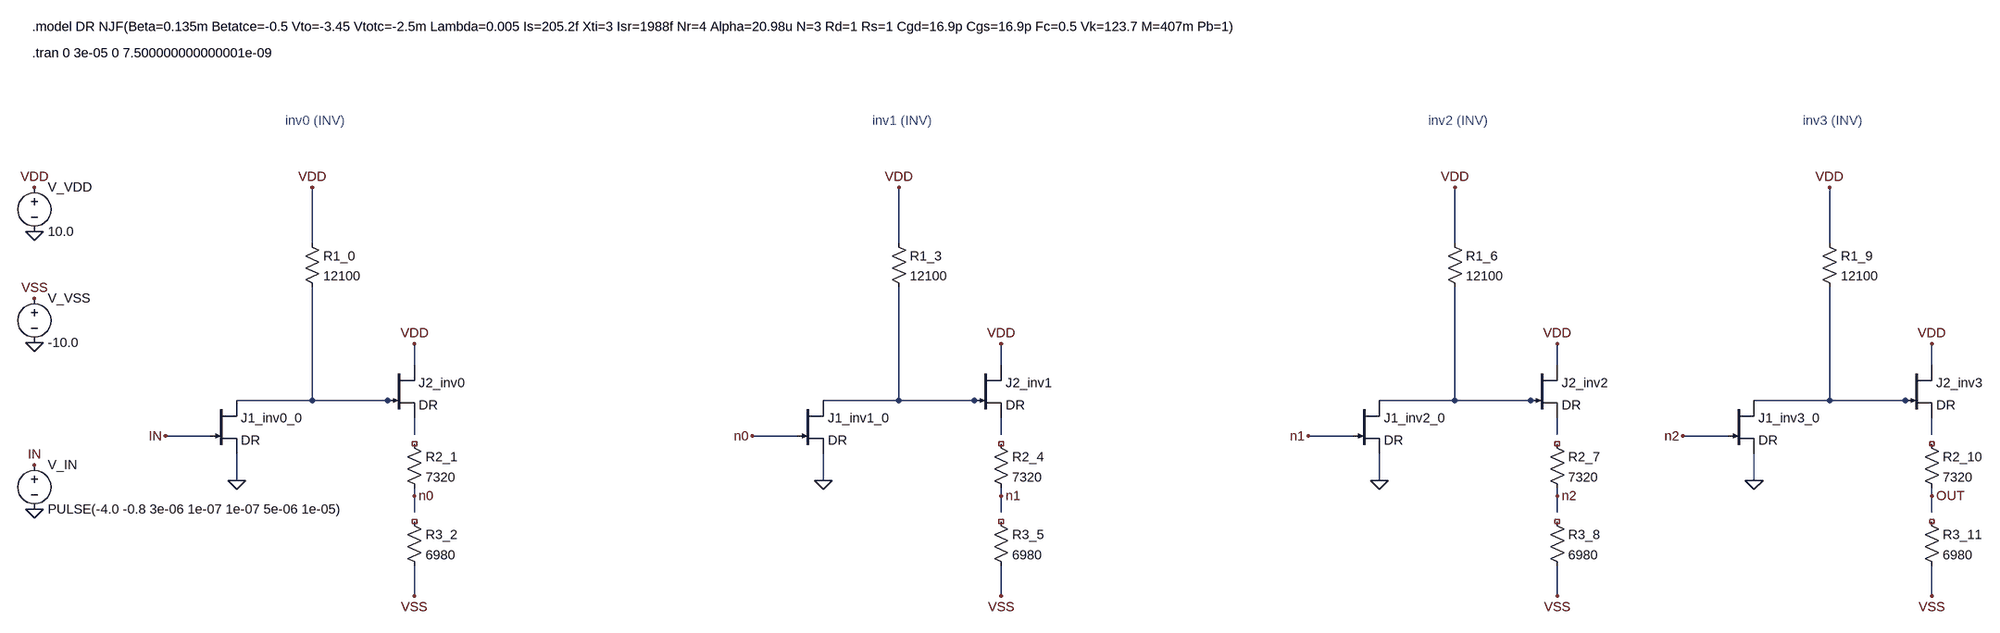
[diagram p0: schematic inv_chain_4_v2.asc]
inv_chain_4_v2.asc, the LTspice schematic file:
Version 4
SHEET 1 10000 10000
WIRE 0 116 0 16
FLAG 0 16 VDD
SYMBOL res -16 100 R0
SYMATTR InstName R1_0
SYMATTR Value 12100
WIRE 0 400 0 196
WIRE 0 400 -136 400
SYMBOL njf -184 400 R0
SYMATTR InstName J1_inv0_0
SYMATTR Value DR
WIRE -136 496 -136 544
FLAG -136 544 0
WIRE -184 464 -264 464
FLAG -264 464 IN
WIRE 0 400 136 400
SYMBOL njf 136 336 R0
SYMATTR InstName J2_inv0
SYMATTR Value DR
WIRE 184 336 184 298
FLAG 184 298 VDD
WIRE 136 400 136 400
WIRE 184 432 184 462
SYMBOL res 168 462 R0
SYMATTR InstName R2_1
SYMATTR Value 7320
WIRE 184 558 184 572
FLAG 184 572 n0
WIRE 184 572 184 602
SYMBOL res 168 602 R0
SYMATTR InstName R3_2
SYMATTR Value 6980
WIRE 184 698 184 752
FLAG 184 752 VSS
TEXT -48 -104 Left 2 ;inv0 (INV)
WIRE 1056 116 1056 16
FLAG 1056 16 VDD
SYMBOL res 1040 100 R0
SYMATTR InstName R1_3
SYMATTR Value 12100
WIRE 1056 400 1056 196
WIRE 1056 400 920 400
SYMBOL njf 872 400 R0
SYMATTR InstName J1_inv1_0
SYMATTR Value DR
WIRE 920 496 920 544
FLAG 920 544 0
WIRE 872 464 792 464
FLAG 792 464 n0
WIRE 1056 400 1192 400
SYMBOL njf 1192 336 R0
SYMATTR InstName J2_inv1
SYMATTR Value DR
WIRE 1240 336 1240 298
FLAG 1240 298 VDD
WIRE 1192 400 1192 400
WIRE 1240 432 1240 462
SYMBOL res 1224 462 R0
SYMATTR InstName R2_4
SYMATTR Value 7320
WIRE 1240 558 1240 572
FLAG 1240 572 n1
WIRE 1240 572 1240 602
SYMBOL res 1224 602 R0
SYMATTR InstName R3_5
SYMATTR Value 6980
WIRE 1240 698 1240 752
FLAG 1240 752 VSS
TEXT 1008 -104 Left 2 ;inv1 (INV)
WIRE 2112 116 2112 16
FLAG 2112 16 VDD
SYMBOL res 2096 100 R0
SYMATTR InstName R1_6
SYMATTR Value 12100
WIRE 2112 400 2112 196
WIRE 2112 400 1976 400
SYMBOL njf 1928 400 R0
SYMATTR InstName J1_inv2_0
SYMATTR Value DR
WIRE 1976 496 1976 544
FLAG 1976 544 0
WIRE 1928 464 1848 464
FLAG 1848 464 n1
WIRE 2112 400 2248 400
SYMBOL njf 2248 336 R0
SYMATTR InstName J2_inv2
SYMATTR Value DR
WIRE 2296 336 2296 298
FLAG 2296 298 VDD
WIRE 2248 400 2248 400
WIRE 2296 432 2296 462
SYMBOL res 2280 462 R0
SYMATTR InstName R2_7
SYMATTR Value 7320
WIRE 2296 558 2296 572
FLAG 2296 572 n2
WIRE 2296 572 2296 602
SYMBOL res 2280 602 R0
SYMATTR InstName R3_8
SYMATTR Value 6980
WIRE 2296 698 2296 752
FLAG 2296 752 VSS
TEXT 2064 -104 Left 2 ;inv2 (INV)
WIRE 3168 116 3168 16
FLAG 3168 16 VDD
SYMBOL res 3152 100 R0
SYMATTR InstName R1_9
SYMATTR Value 12100
WIRE 3168 400 3168 196
WIRE 3168 400 3032 400
SYMBOL njf 2984 400 R0
SYMATTR InstName J1_inv3_0
SYMATTR Value DR
WIRE 3032 496 3032 544
FLAG 3032 544 0
WIRE 2984 464 2904 464
FLAG 2904 464 n2
WIRE 3168 400 3304 400
SYMBOL njf 3304 336 R0
SYMATTR InstName J2_inv3
SYMATTR Value DR
WIRE 3352 336 3352 298
FLAG 3352 298 VDD
WIRE 3304 400 3304 400
WIRE 3352 432 3352 462
SYMBOL res 3336 462 R0
SYMATTR InstName R2_10
SYMATTR Value 7320
WIRE 3352 558 3352 572
FLAG 3352 572 OUT
WIRE 3352 572 3352 602
SYMBOL res 3336 602 R0
SYMATTR InstName R3_11
SYMATTR Value 6980
WIRE 3352 698 3352 752
FLAG 3352 752 VSS
TEXT 3120 -104 Left 2 ;inv3 (INV)
FLAG -500 16 VDD
FLAG -500 96 0
SYMBOL voltage -500 0 R0
SYMATTR InstName V_VDD
SYMATTR Value 10.0
FLAG -500 216 VSS
FLAG -500 296 0
SYMBOL voltage -500 200 R0
SYMATTR InstName V_VSS
SYMATTR Value -10.0
FLAG -500 516 IN
FLAG -500 596 0
SYMBOL voltage -500 500 R0
SYMATTR InstName V_IN
SYMATTR Value PULSE(-4.0 -0.8 3e-06 1e-07 1e-07 5e-06 1e-05)
TEXT -504 -304 Left 2 !.tran 0 3e-05 0 7.500000000000001e-09
TEXT -504 -352 Left 2 !.model DR NJF(Beta=0.135m Betatce=-0.5 Vto=-3.45 Vtotc=-2.5m Lambda=0.005 Is=205.2f Xti=3 Isr=1988f Nr=4 Alpha=20.98u N=3 Rd=1 Rs=1 Cgd=16.9p Cgs=16.9p Fc=0.5 Vk=123.7 M=407m Pb=1)

The netlist it stands for:
* inv_chain_4_v2.asc
R1_0 VDD N001 12100
J1_inv0_0 N001 IN 0 DR
J2_inv0 VDD N001 N002 DR
R2_1 NC_01 n0 7320
R3_2 NC_02 VSS 6980
R1_3 VDD N003 12100
J1_inv1_0 N003 n0 0 DR
J2_inv1 VDD N003 N004 DR
R2_4 NC_03 n1 7320
R3_5 NC_04 VSS 6980
R1_6 VDD N005 12100
J1_inv2_0 N005 n1 0 DR
J2_inv2 VDD N005 N006 DR
R2_7 NC_05 n2 7320
R3_8 NC_06 VSS 6980
R1_9 VDD N007 12100
J1_inv3_0 N007 n2 0 DR
J2_inv3 VDD N007 N008 DR
R2_10 NC_07 OUT 7320
R3_11 NC_08 VSS 6980
V_VDD VDD 0 10.0
V_VSS VSS 0 -10.0
V_IN IN 0 PULSE(-4.0 -0.8 3e-06 1e-07 1e-07 5e-06 1e-05)
.model NJF NJF
.model PJF PJF
.lib standard.jft
* inv0 (INV)
* inv1 (INV)
* inv2 (INV)
* inv3 (INV)
.tran 0 3e-05 0 7.500000000000001e-09
.model DR NJF(Beta=0.135m Betatce=-0.5 Vto=-3.45 Vtotc=-2.5m Lambda=0.005 Is=205.2f Xti=3 Isr=1988f Nr=4 Alpha=20.98u N=3 Rd=1 Rs=1 Cgd=16.9p Cgs=16.9p Fc=0.5 Vk=123.7 M=407m Pb=1)
.backanno
.end